# Altium schematic sheet TopLevel.SchDoc
size A; SheetNumber: 1; SheetTotal: 8
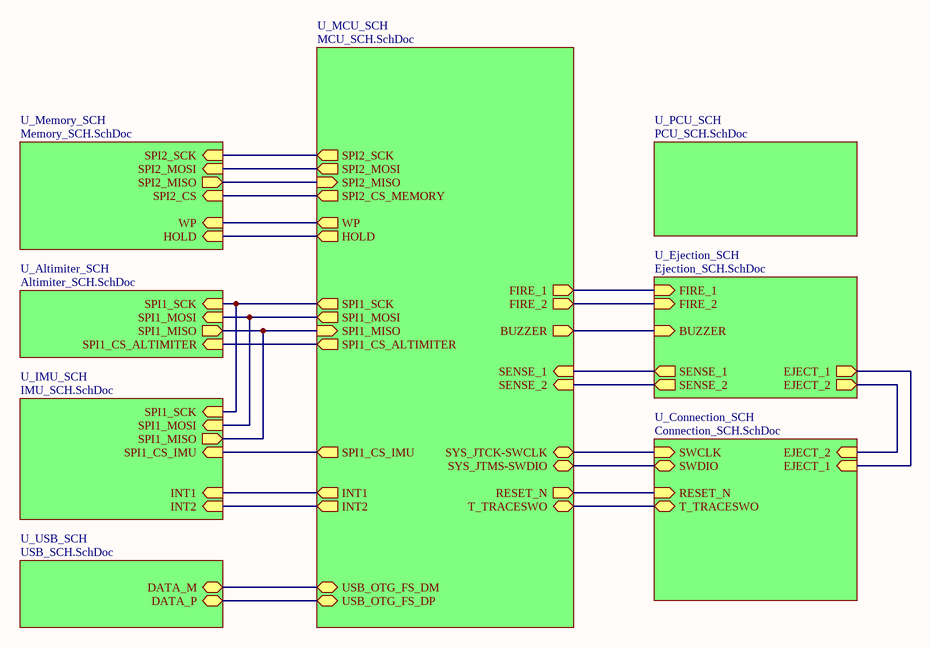
[diagram p0: TopLevel.SchDoc]

## Sub-sheets
U_Altimiter_SCH = Altimiter_SCH.SchDoc: SPI1_SCK (in), SPI1_MOSI (in), SPI1_MISO (out), SPI1_CS_ALTIMITER (in)
U_Connection_SCH = Connection_SCH.SchDoc: SWCLK (in), SWDIO (bidir), T_TRACESWO (bidir), RESET_N (in), EJECT_1 (in), EJECT_2 (in)
U_Ejection_SCH = Ejection_SCH.SchDoc: SENSE_1 (out), SENSE_2 (out), EJECT_1 (out), EJECT_2 (out), FIRE_1 (in), FIRE_2 (in), BUZZER (in)
U_IMU_SCH = IMU_SCH.SchDoc: SPI1_MOSI (in), SPI1_MISO (out), SPI1_CS_IMU (in), SPI1_SCK (in), INT2 (in), INT1 (in)
U_MCU_SCH = MCU_SCH.SchDoc: RESET_N (out), USB_OTG_FS_DM (bidir), USB_OTG_FS_DP (bidir), SYS_JTMS-SWDIO (bidir), SYS_JTCK-SWCLK (bidir), SPI2_SCK (out), SPI2_MISO (in), SPI2_MOSI (out), SPI1_SCK (out), SPI1_MISO (in), SPI1_MOSI (out), WP (out), HOLD (out), INT1 (out), INT2 (out), FIRE_1 (out), FIRE_2 (out), SENSE_1 (in), SENSE_2 (in), SPI2_CS_MEMORY (out), T_TRACESWO (bidir), SPI1_CS_ALTIMITER (out), SPI1_CS_IMU (out), BUZZER (out)
U_Memory_SCH = Memory_SCH.SchDoc: SPI2_SCK (in), WP (in), HOLD (in), SPI2_MOSI (in), SPI2_MISO (out), SPI2_CS (in)
U_PCU_SCH = PCU_SCH.SchDoc: no entries
U_USB_SCH = USB_SCH.SchDoc: DATA_M (bidir), DATA_P (bidir)

## Nets
(unnamed): sheet U_Altimiter_SCH/SPI1_SCK, sheet U_MCU_SCH/SPI1_SCK, sheet U_IMU_SCH/SPI1_SCK
(unnamed): sheet U_Altimiter_SCH/SPI1_MOSI, sheet U_MCU_SCH/SPI1_MOSI, sheet U_IMU_SCH/SPI1_MOSI
(unnamed): sheet U_Altimiter_SCH/SPI1_MISO, sheet U_MCU_SCH/SPI1_MISO, sheet U_IMU_SCH/SPI1_MISO
(unnamed): sheet U_Altimiter_SCH/SPI1_CS_ALTIMITER, sheet U_MCU_SCH/SPI1_CS_ALTIMITER
(unnamed): sheet U_MCU_SCH/RESET_N, sheet U_Connection_SCH/RESET_N
(unnamed): sheet U_MCU_SCH/USB_OTG_FS_DM, sheet U_USB_SCH/DATA_M
(unnamed): sheet U_MCU_SCH/USB_OTG_FS_DP, sheet U_USB_SCH/DATA_P
(unnamed): sheet U_MCU_SCH/SYS_JTMS-SWDIO, sheet U_Connection_SCH/SWDIO
(unnamed): sheet U_MCU_SCH/SYS_JTCK-SWCLK, sheet U_Connection_SCH/SWCLK
(unnamed): sheet U_MCU_SCH/SPI2_SCK, sheet U_Memory_SCH/SPI2_SCK
(unnamed): sheet U_MCU_SCH/SPI2_MISO, sheet U_Memory_SCH/SPI2_MISO
(unnamed): sheet U_MCU_SCH/SPI2_MOSI, sheet U_Memory_SCH/SPI2_MOSI
(unnamed): sheet U_MCU_SCH/WP, sheet U_Memory_SCH/WP
(unnamed): sheet U_MCU_SCH/HOLD, sheet U_Memory_SCH/HOLD
(unnamed): sheet U_MCU_SCH/INT1, sheet U_IMU_SCH/INT1
(unnamed): sheet U_MCU_SCH/INT2, sheet U_IMU_SCH/INT2
(unnamed): sheet U_MCU_SCH/FIRE_1, sheet U_Ejection_SCH/FIRE_1
(unnamed): sheet U_MCU_SCH/FIRE_2, sheet U_Ejection_SCH/FIRE_2
(unnamed): sheet U_MCU_SCH/SENSE_1, sheet U_Ejection_SCH/SENSE_1
(unnamed): sheet U_MCU_SCH/SENSE_2, sheet U_Ejection_SCH/SENSE_2
(unnamed): sheet U_MCU_SCH/SPI2_CS_MEMORY, sheet U_Memory_SCH/SPI2_CS
(unnamed): sheet U_MCU_SCH/T_TRACESWO, sheet U_Connection_SCH/T_TRACESWO
(unnamed): sheet U_MCU_SCH/SPI1_CS_IMU, sheet U_IMU_SCH/SPI1_CS_IMU
(unnamed): sheet U_MCU_SCH/BUZZER, sheet U_Ejection_SCH/BUZZER
(unnamed): sheet U_Connection_SCH/EJECT_1, sheet U_Ejection_SCH/EJECT_1
(unnamed): sheet U_Connection_SCH/EJECT_2, sheet U_Ejection_SCH/EJECT_2